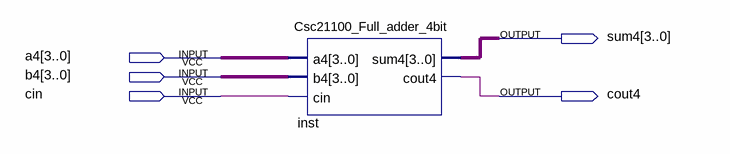
[diagram p0: schematic sheet]
// Quartus schematic Block.bdf as structural Verilog: 1 symbols, 5 pins
module Block (
  input  [3:0] a4,
  input  [3:0] b4,
  input  cin,
  output [3:0] sum4,
  output cout4
);

  Csc21100_Full_adder_4bit inst (.a4(a4), .b4(b4), .cin(cin), .sum4(sum4), .cout4(cout4));
endmodule
